# Altium schematic sheet microcontroller.SchDoc: <?>
size 420 x 297 mm; ApprovedBy: <?>; CheckedBy: <?>; CompanyName: ISON IMPORT-EXPORT COMPANY LIMITED; DrawnBy: <?>; DocumentNumber: <?>; Revision: <?>; SheetNumber: <?>; SheetTotal: <?>; Size: A3; ISON_Model: <?>
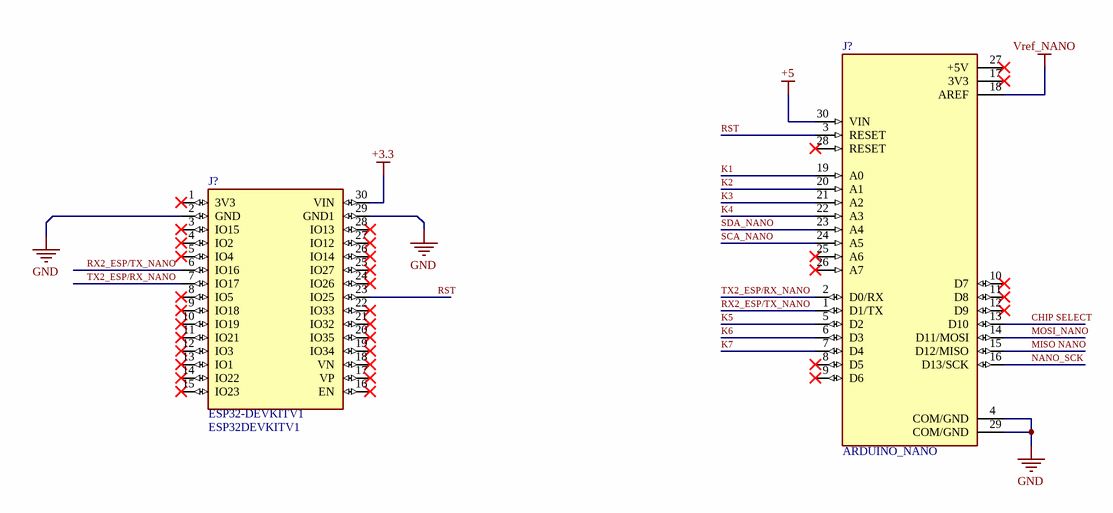
[diagram p0: microcontroller.SchDoc]

## Parts
(Parts that share a designator on the sheet are numbered #1, #2 ... from top to bottom, then left to right.)
J?#1  ESP32DEVKITV1  [ESP32-DEVKITV1_3D]
J?#2  ARDUINO_NANO  [SHIELD_ARDUINO_NANO]

## Nets
+3.3: J?#1.30(VIN)
+5: J?#2.30(VIN)
GND: J?#1.2(GND) J?#1.29(GND1) J?#2.4(COM/GND) J?#2.29(COM/GND)
Vref_NANO: J?#2.18(AREF)
CHIP SELECT: J?#2.13(D10)
K1: J?#2.19(A0)
K2: J?#2.20(A1)
K3: J?#2.21(A2)
K4: J?#2.22(A3)
K5: J?#2.5(D2)
K6: J?#2.6(D3)
K7: J?#2.7(D4)
MISO NANO: J?#2.15(D12/MISO)
MOSI_NANO: J?#2.14(D11/MOSI)
NANO_SCK: J?#2.16(D13/SCK)
RST: J?#1.23(IO25) J?#2.3(RESET)
RX2_ESP/TX_NANO: J?#1.6(IO16) J?#2.1(D1/TX)
SCA_NANO: J?#2.24(A5)
SDA_NANO: J?#2.23(A4)
TX2_ESP/RX_NANO: J?#1.7(IO17) J?#2.2(D0/RX)

Not connected (* = marked no-connect by the designer): J?#1 1(3V3)* 3(IO15)* 4(IO2)* 5(IO4)* 8(IO5)* 9(IO18)* 10(IO19)* 11(IO21)* 12(IO3)* 13(IO1)* 14(IO22)* 15(IO23)* 16(EN)* 17(VP)* 18(VN)* 19(IO34)* 20(IO35)* 21(IO32)* 22(IO33)* 24(IO26)* 25(IO27)* 26(IO14)* 27(IO12)* 28(IO13)*; J?#2 8(D5)* 9(D6)* 10(D7)* 11(D8)* 12(D9)* 17(3V3)* 25(A6)* 26(A7)* 27(+5V)* 28(RESET)*

## Notes on the sheet
- Modify 1:
- DWG No:
- Model:
- SHEET:
- Modify 2:
- ORIGINAL:
- Revision:
- Date:
- Draw By:
- Size:
- File:
- Approve By:
- TOTAL:
- Modify 3:
- (in symbol ESP32DEVKITV1) ESP32-DEVKITV1

## Library data of the parts
J?#1 = ESP32DEVKITV1: Dual core, Wi-Fi: 2.4 GHz up to 150 Mbits/s,BLE (Bluetooth Low Energy) and legacy Bluetooth, 32 bits, Up to 240 MHz; MF: Do it; Check_prices: https://www.snapeda.com/parts/ESP32%20DEVKIT%20V1/Do%20it/view-part/5659245/?ref=eda; Value: *; SnapEDA_Link: https://www.snapeda.com/parts/ESP32%20DEVKIT%20V1/Do%20it/view-part/5659245/?ref=snap; Package: Package; Availability: Unavailable; Price: None; MP: ESP32 DEVKIT V1
J?#2 = ARDUINO_NANO: Small, complete, and breadboard-friendly board based on the ATmega328 (Arduino Nano 3.x); Check_prices: https://www.snapeda.com/parts/Arduino%20Nano/Arduino/view-part/?ref=eda; Value: *; Availability: Not in stock; MP: Arduino Nano; Price: None; Package: Non-Standard Arduino; SnapEDA_Link: https://www.snapeda.com/parts/Arduino%20Nano/Arduino/view-part/?ref=snap; MF: Arduino